# EAGLE board SNCHN_II-03 (EAGLE 5.11), part 1 of 2
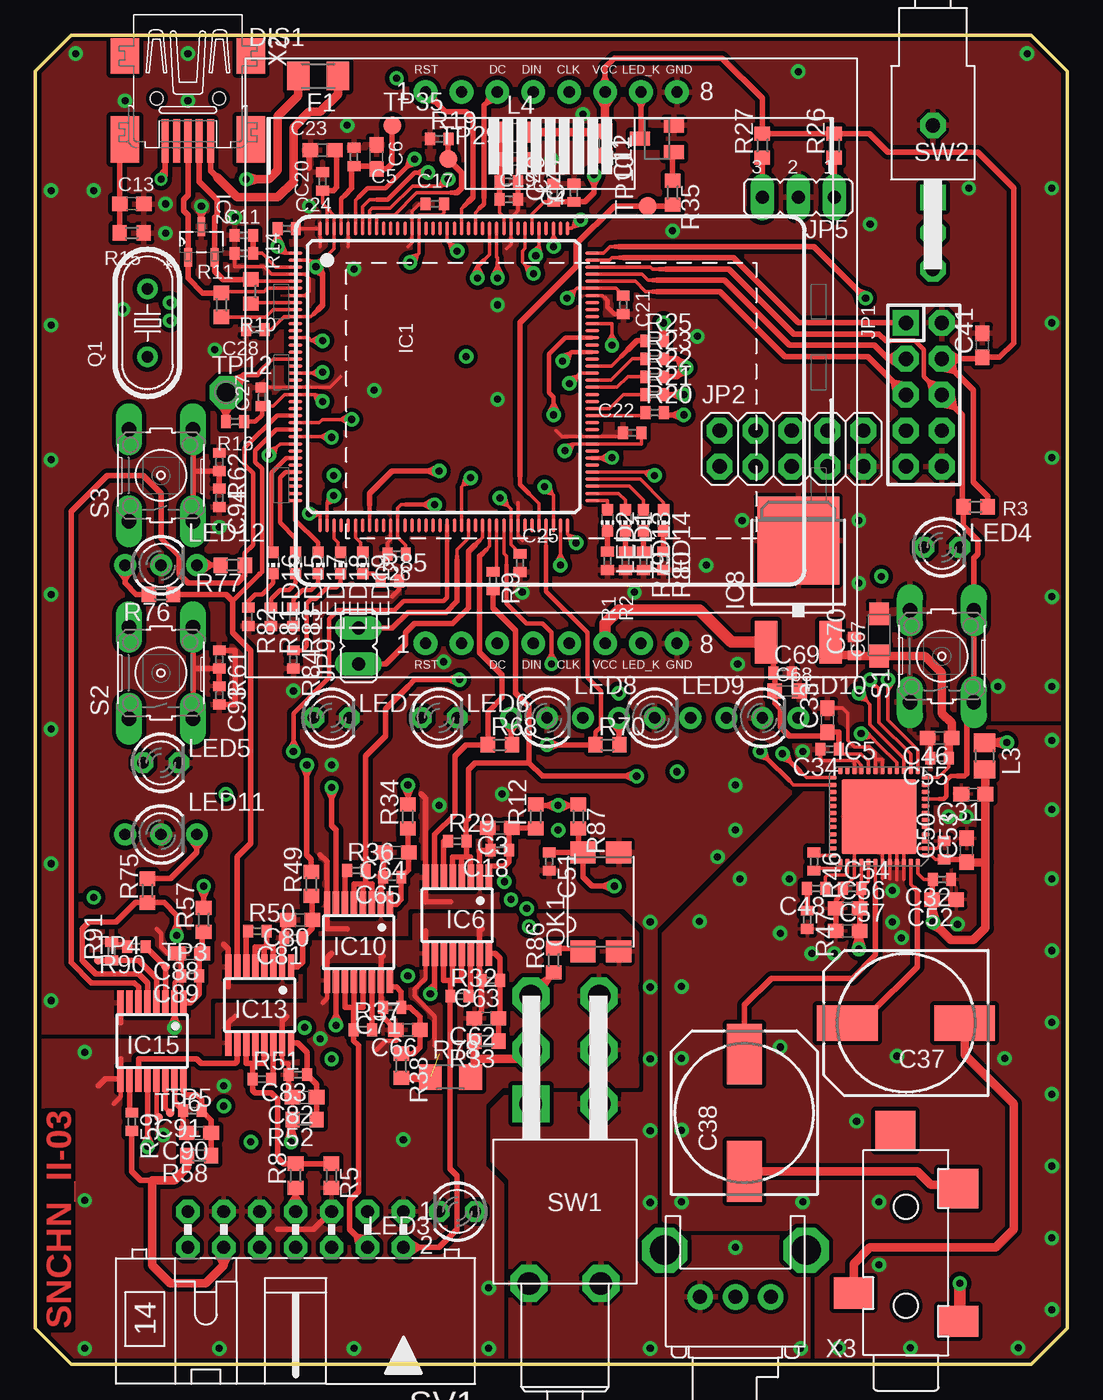
[diagram p5: board, top side]
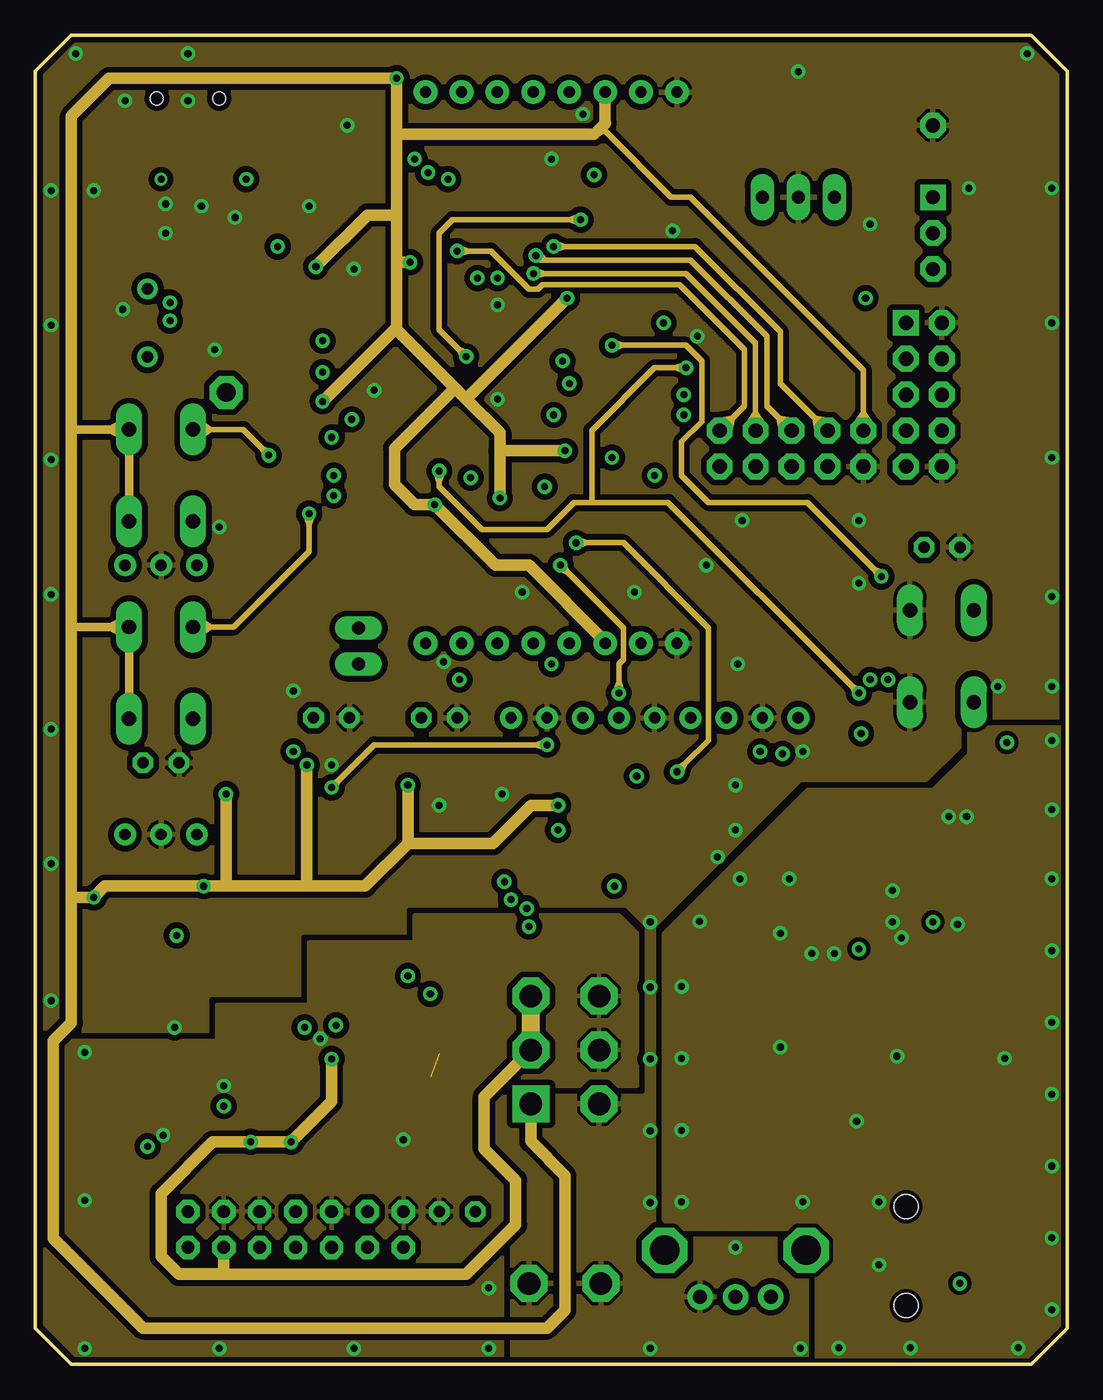
[diagram p6: board, inner layer Route2]
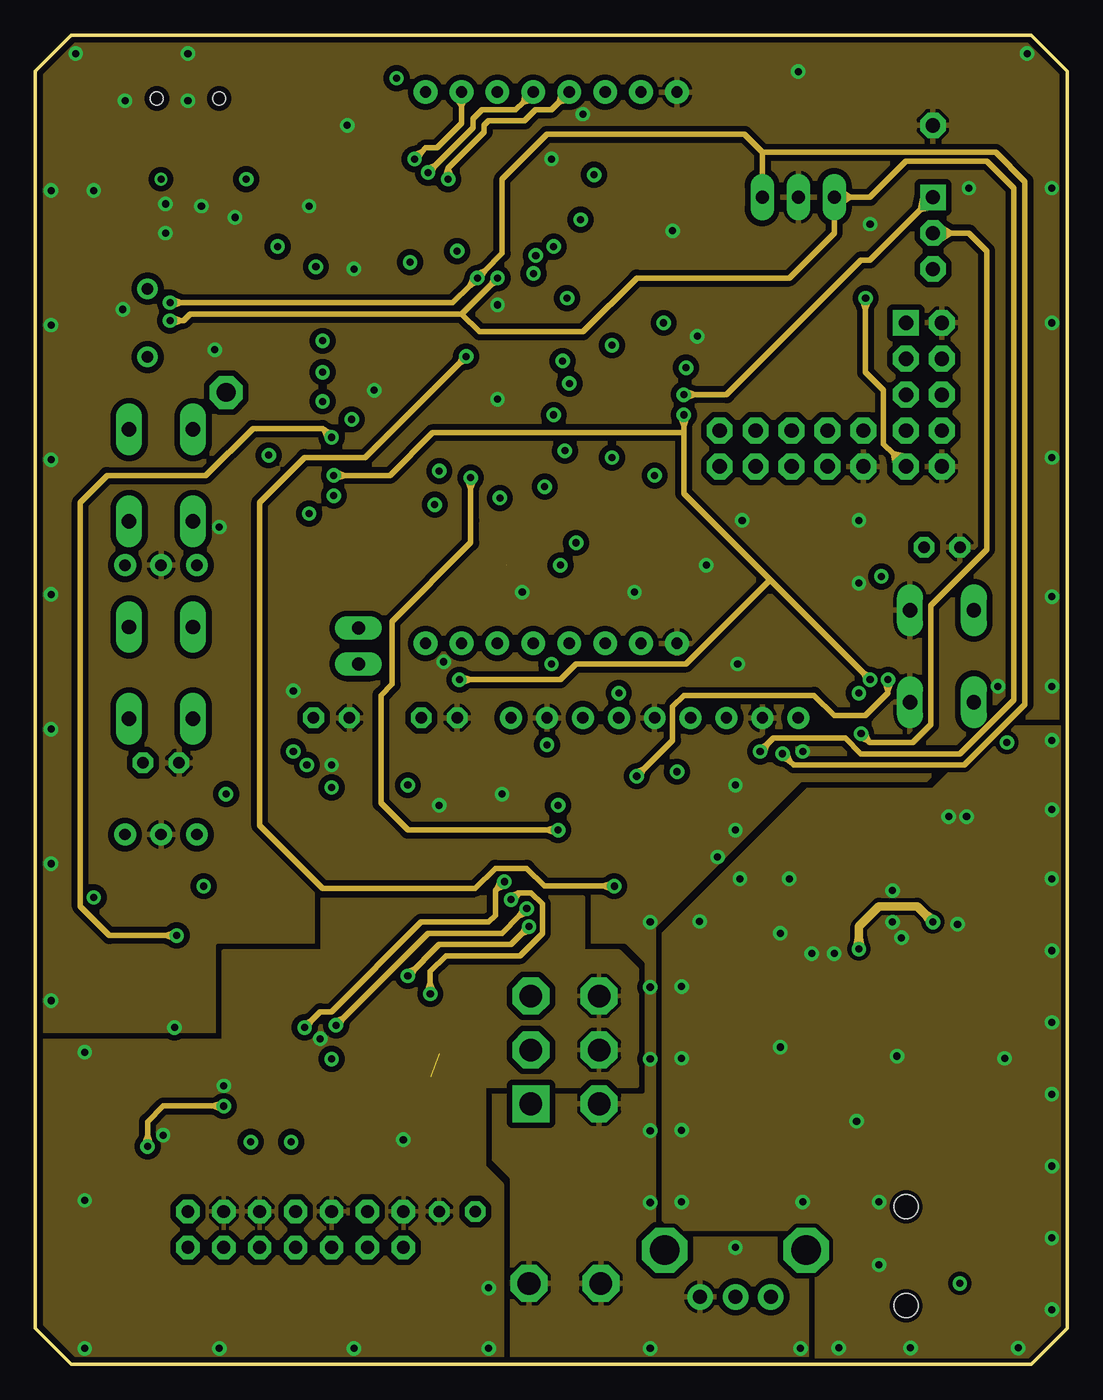
[diagram p7: board, inner layer Route15]
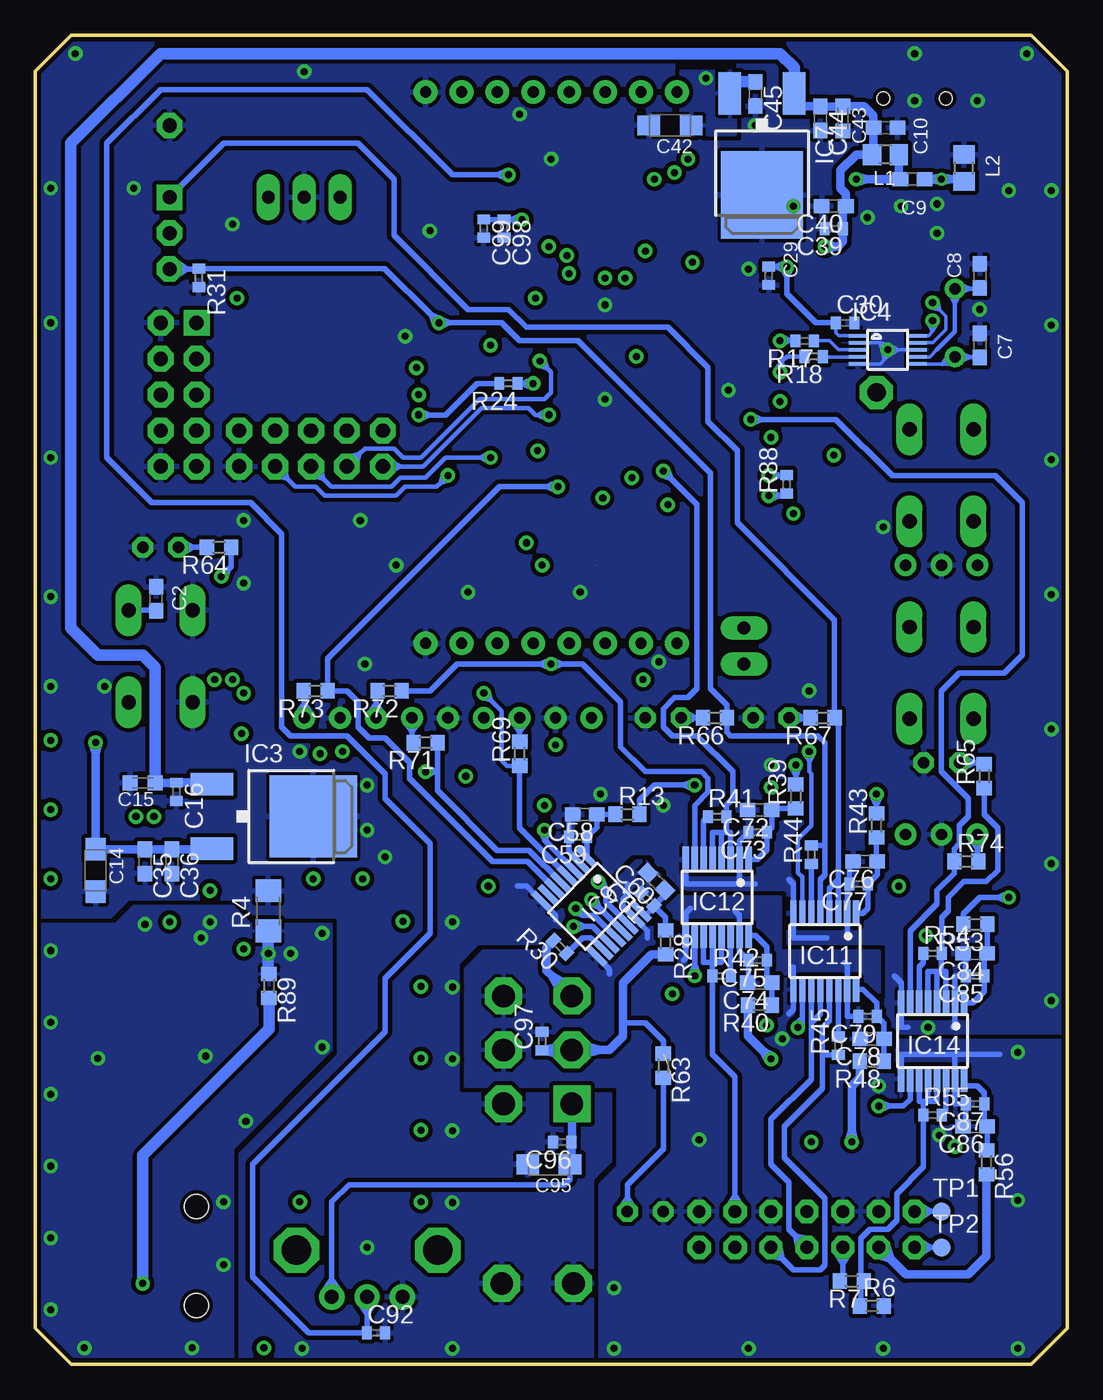
[diagram p8: board, bottom side, seen from below]

Size 73 x 94 mm. Coordinates in mm from the lower left corner, seen from the top.
Outline: 73,91.46 70.46,94 2.54,94 0,91.46 0,2.54 2.54,0 70.46,0 73,2.54 73,91.46
Copper layers (1*2*15*16): Top 0.035mm / dielectric 0.45mm / Route2 0.035mm / dielectric 0.45mm / Route15 0.035mm / dielectric 0.45mm / Bottom 0.035mm
Design rules "gatema_4_layers *": minimum track width 0.2mm, minimum drill 0.5mm, track to track 0.2mm, track to pad 0.2mm, pad to pad 0.2mm, via to via 0.2mm, smd to smd 0.2mm, copper to edge 0.3mm, drill to drill 8mil, minimum pad ring 10mil, minimum via ring 8mil, stop-mask expansion 4mil, vias tented up to drill 0.6mm, thermal gap 10mil
Net classes: 0 default: width 0.254 mm, drill 0.5 mm, clearance 0.2 mm; 1 High Speed: width 0.254 mm, drill 0.5 mm, clearance 0.508 mm
tKeepout: area 0,0 to 5.1,94; area 68.1,0 to 73,94
tRestrict: area 19.7,90.2 to 20.3,92.1; area 59.1,51.1 to 60.3,52.1; area 43.7,86.2 to 44.3,87.2
bRestrict: area 68.1,34.4 to 69.4,35.4; area 27.6,87 to 28.6,88.3; area 36.2,13.5 to 37.1,14.8; area 6.3,28.7 to 6.7,29.1

## Footprints (pad centres in the part's own frame; a part is rotated, then mirrored left to right if it is on the bottom)
C0402 = smd 0.7 x 0.9: 1 -0.65,0; 2 0.65,0
C0603 = smd 1.1 x 1: 1 -0.85,0; 2 0.85,0
SMC_A = smd 1.6 x 1.4: + -1.5,0; - 1.5,0
C0603R = smd 1.05 x 1.08: 1 -0.875,0; 2 0.875,0
140CLH-1010 = smd 4.3 x 2.5: + 4.15,0; - -4.15,0
LCD_NOKIA_5510_PLUS_EXT_BRD = drill 0.8 pad 1.676 round: 1 -8.89,19.5; 1@1 -8.89,-19.5; 2 -6.35,19.5; 2@1 -6.35,-19.5; 3 -3.81,19.5; 3@1 -3.81,-19.5; 4 -1.27,19.5; 4@1 -1.27,-19.5; 5 1.27,19.5; 5@1 1.27,-19.5; 6 3.81,19.5; 6@1 3.81,-19.5; 7 6.35,19.5; 7@1 6.35,-19.5; 8 8.89,19.5; 8@1 8.89,-19.5
M1206 = smd 1.6 x 2: 1 -1.4,0; 2 1.4,0
LQFP144 = smd 0.25 x 1: 1 -8.75,-10.5; 2 -8.25,-10.5; 3 -7.75,-10.5; 4 -7.25,-10.5; 5 -6.75,-10.5; 6 -6.25,-10.5; 7 -5.75,-10.5; 8 -5.25,-10.5; 9 -4.75,-10.5; 10 -4.25,-10.5; 11 -3.75,-10.5; 12 -3.25,-10.5; 13 -2.75,-10.5; 14 -2.25,-10.5; 15 -1.75,-10.5; 16 -1.25,-10.5; 17 -0.75,-10.5; 18 -0.25,-10.5; 19 0.25,-10.5; 20 0.75,-10.5; 21 1.25,-10.5; 22 1.75,-10.5; 23 2.25,-10.5; 24 2.75,-10.5; 25 3.25,-10.5; 26 3.75,-10.5; 27 4.25,-10.5; 28 4.75,-10.5; 29 5.25,-10.5; 30 5.75,-10.5; 31 6.25,-10.5; 32 6.75,-10.5; 33 7.25,-10.5; 34 7.75,-10.5; 35 8.25,-10.5; 36 8.75,-10.5; 73 8.75,10.5; 74 8.25,10.5; 75 7.75,10.5; 76 7.25,10.5; 77 6.75,10.5; 78 6.25,10.5; 79 5.75,10.5; 80 5.25,10.5; 81 4.75,10.5; 82 4.25,10.5; 83 3.75,10.5; 84 3.25,10.5; 85 2.75,10.5; 86 2.25,10.5; 87 1.75,10.5; 88 1.25,10.5; 89 0.75,10.5; 90 0.25,10.5; 91 -0.25,10.5; 92 -0.75,10.5; 93 -1.25,10.5; 94 -1.75,10.5; 95 -2.25,10.5; 96 -2.75,10.5; 97 -3.25,10.5; 98 -3.75,10.5; 99 -4.25,10.5; 100 -4.75,10.5; 101 -5.25,10.5; 102 -5.75,10.5; 103 -6.25,10.5; 104 -6.75,10.5; 105 -7.25,10.5; 106 -7.75,10.5; 107 -8.25,10.5; 108 -8.75,10.5 | smd 1 x 0.25: 37 10.5,-8.75; 38 10.5,-8.25; 39 10.5,-7.75; 40 10.5,-7.25; 41 10.5,-6.75; 42 10.5,-6.25; 43 10.5,-5.75; 44 10.5,-5.25; 45 10.5,-4.75; 46 10.5,-4.25; 47 10.5,-3.75; 48 10.5,-3.25; 49 10.5,-2.75; 50 10.5,-2.25; 51 10.5,-1.75; 52 10.5,-1.25; 53 10.5,-0.75; 54 10.5,-0.25; 55 10.5,0.25; 56 10.5,0.75; 57 10.5,1.25; 58 10.5,1.75; 59 10.5,2.25; 60 10.5,2.75; 61 10.5,3.25; 62 10.5,3.75; 63 10.5,4.25; 64 10.5,4.75; 65 10.5,5.25; 66 10.5,5.75; 67 10.5,6.25; 68 10.5,6.75; 69 10.5,7.25; 70 10.5,7.75; 71 10.5,8.25; 72 10.5,8.75; 109 -10.5,8.75; 110 -10.5,8.25; 111 -10.5,7.75; 112 -10.5,7.25; 113 -10.5,6.75; 114 -10.5,6.25; 115 -10.5,5.75; 116 -10.5,5.25; 117 -10.5,4.75; 118 -10.5,4.25; 119 -10.5,3.75; 120 -10.5,3.25; 121 -10.5,2.75; 122 -10.5,2.25; 123 -10.5,1.75; 124 -10.5,1.25; 125 -10.5,0.75; 126 -10.5,0.25; 127 -10.5,-0.25; 128 -10.5,-0.75; 129 -10.5,-1.25; 130 -10.5,-1.75; 131 -10.5,-2.25; 132 -10.5,-2.75; 133 -10.5,-3.25; 134 -10.5,-3.75; 135 -10.5,-4.25; 136 -10.5,-4.75; 137 -10.5,-5.25; 138 -10.5,-5.75; 139 -10.5,-6.25; 140 -10.5,-6.75; 141 -10.5,-7.25; 142 -10.5,-7.75; 143 -10.5,-8.25; 144 -10.5,-8.75
SOT95P237X112-3N = smd 1.321 x 0.559: 1 -1.092,0.94; 2 -1.092,-0.94; 3 1.092,0
DPACK = smd 1.6 x 3: 1 -2.28,-4.8; 3 2.28,-4.8 | smd 5.8 x 6.2: 4 0,2.38
MSOP10 = smd 0.25 x 1.3: 1 -1,-2.113; 2 -0.5,-2.113; 3 0,-2.113; 4 0.5,-2.113; 5 1,-2.113; 6 1,2.113; 7 0.5,2.113; 8 0,2.113; 9 -0.5,2.113; 10 -1,2.113
QFN48 = smd 0.55 x 0.3: 1 -3.275,2.75; 2 -3.275,2.25; 3 -3.275,1.75; 4 -3.275,1.25; 5 -3.275,0.75; 6 -3.275,0.25; 7 -3.275,-0.25; 8 -3.275,-0.75; 9 -3.275,-1.25; 10 -3.275,-1.75; 11 -3.275,-2.25; 12 -3.275,-2.75; 25 3.275,-2.75; 26 3.275,-2.25; 27 3.275,-1.75; 28 3.275,-1.25; 29 3.275,-0.75; 30 3.275,-0.25; 31 3.275,0.25; 32 3.275,0.75; 33 3.275,1.25; 34 3.275,1.75; 35 3.275,2.25; 36 3.275,2.75 | smd 0.3 x 0.55: 13 -2.75,-3.275; 14 -2.25,-3.275; 15 -1.75,-3.275; 16 -1.25,-3.275; 17 -0.75,-3.275; 18 -0.25,-3.275; 19 0.25,-3.275; 20 0.75,-3.275; 21 1.25,-3.275; 22 1.75,-3.275; 23 2.25,-3.275; 24 2.75,-3.275; 37 2.75,3.275; 38 2.25,3.275; 39 1.75,3.275; 40 1.25,3.275; 41 0.75,3.275; 42 0.25,3.275; 43 -0.25,3.275; 44 -0.75,3.275; 45 -1.25,3.275; 46 -1.75,3.275; 47 -2.25,3.275; 48 -2.75,3.275 | smd 5.309 x 5.309: EXP 0,0
QSOP16 = smd 0.45 x 1.8: 1 -2.223,-2.69; 2 -1.587,-2.69; 3 -0.953,-2.69; 4 -0.318,-2.69; 5 0.318,-2.69; 6 0.953,-2.69; 7 1.587,-2.69; 8 2.223,-2.69; 9 2.223,2.69; 10 1.587,2.69; 11 0.953,2.69; 12 0.318,2.69; 13 -0.318,2.69; 14 -0.953,2.69; 15 -1.587,2.69; 16 -2.223,2.69
AVR-JTAG-10 = drill 1.016 square: 1 -5.08,-1.27 | drill 1.016 octagon: 2 -5.08,1.27; 3 -2.54,-1.27; 4 -2.54,1.27; 5 0,-1.27; 6 0,1.27; 7 2.54,-1.27; 8 2.54,1.27; 9 5.08,-1.27; 10 5.08,1.27
2X05 = drill 1.016 octagon: 1 -5.08,-1.27; 2 -5.08,1.27; 3 -2.54,-1.27; 4 -2.54,1.27; 5 0,-1.27; 6 0,1.27; 7 2.54,-1.27; 8 2.54,1.27; 9 5.08,-1.27; 10 5.08,1.27
JP2 = drill 0.914 long: 1 -2.54,0; 2 0,0; 3 2.54,0
JP1 = drill 0.914 long: 1 0,-1.27; 2 0,1.27
L0805 = smd 1.3 x 1.5: 1 -0.95,0; 2 0.95,0
CHIP-LED0603 = smd 0.8 x 0.8: A 0,-0.75; C 0,0.75
LED3MM = drill 0.813 octagon: A -1.27,0; K 1.27,0
DUOLED-C-3MM = drill 0.8 pad 1.55 round: AR 2.54,0; AX -2.54,0; C 0,0
SMD4 = smd 1.78 x 1.55: 1 -1.27,-3.5; 2 1.27,-3.5; 3 1.27,3.5; 4 -1.27,3.5
HC49U-V = drill 0.813 round: 1 -2.413,0; 2 2.413,0
R0402 = smd 0.7 x 0.9: 1 -0.65,0; 2 0.65,0
R0603 = smd 1 x 1.1: 1 -0.85,0; 2 0.85,0
R1206 = smd 1.6 x 1.803: 1 -1.422,0; 2 1.422,0
TRIM_RK09K1110AK4 = drill 1 pad 1.676 round: 1 0,-2.5; 2 0,0; 3 0,2.5 | drill 2.1 pad 3.2 octagon: SHIELD_1 -3.3,5; SHIELD_2 -3.3,-5
B3F-10XX = drill 1.016 long: 1 -3.251,2.261; 2 3.251,2.261; 3 -3.251,-2.261; 4 3.251,-2.261
ML14L = drill 0.914 octagon: 1 -7.62,-1.27; 2 -7.62,1.27; 3 -5.08,-1.27; 4 -5.08,1.27; 5 -2.54,-1.27; 6 -2.54,1.27; 7 0,-1.27; 8 0,1.27; 9 2.54,-1.27; 10 2.54,1.27; 11 5.08,-1.27; 12 5.08,1.27; 13 7.62,-1.27; 14 7.62,1.27
1MD3T2B4M7XX = drill 1.6 square: 1 -2.415,0 | drill 1.6 octagon: 2 -2.415,3.81; 3 -2.415,7.62; 4 2.415,0; 5 2.415,3.81; 6 2.415,7.62; SH1 -2.54,-12.7; SH2 2.54,-12.7
2AS2T2A1M7RE = drill 1 square: 1 0,0 | drill 1 octagon: 2 0,2.54; 3 0,5.08; SH 0,-5.08
SC59-BEC = smd 1 x 1.4: B -0.95,-1.2; C 0,1.2; E 0.95,-1.2
B1,27 = smd 1.27 x 1.27: TP 0,0
TP06R = smd 0.6 x 0.6: TP 0,0
P1-13 = drill 1.321 pad 2.159 octagon: TP 0,0
32005-201 = smd 3.1 x 0.5: 1 3,1.6; 2 3,0.8; 3 3,0; 4 3,-0.8; 5 3,-1.6 | smd 2.5 x 2: M1 -3,-4.45; M2 -3,4.45 | smd 3.3 x 2: M3 2.9,4.45; M4 2.9,-4.45 | hole 0.9: 0,2.2; 0,-2.2
STEREO_JACK_3.5MM_SMD_SJ-352X-SMT = smd 2.8 x 2.2: P$1 -3.7,-2.4; P$3 3.7,-4.4 | smd 2.8 x 2.8: P$2 -3.7,-11.8; P$10 0.75,-15.9 | hole 1.7: 0,-3.5; 0,-10.5

## Placement (x,y rotation side)
C1  100n  [C0402]  33.5,83.66 0 top
C2  220n  [C0603]  64.45,54.13 90 bottom
C3  1u  [C0603]  32.86,37.94 180 top
C4  1n  [C0402]  33.5,82.39 0 top
C5  1n  [C0402]  22.54,85.41 90 top
C6  1u  [C0603]  24.13,85.41 90 top
C7  10p(22p)  [C0603]  6.19,72.07 90 bottom
C8  10p(22p)  [C0603]  6.19,76.99 90 bottom
C9  1n  [C0603]  10.95,83.82 0 bottom
C10  100n  [C0603]  12.86,87.47 0 bottom
C11  10pF(22p)  [C0402]  14.76,79.85 180 top
C12  1u  [C0603]  40.32,86.36 270 top
C13  10n  [C0603]  6.83,82.07 0 top
C14  4.7uF  [SMC_A]  68.74,34.92 270 bottom
C15  1uF  [C0603R]  65.41,41.12 180 bottom
C16  100n  [C0402]  63.02,40.48 270 bottom
C17  100n  [C0402]  28.26,82.07 180 top
C18  100n  [C0402]  32.86,36.35 180 top
C19  1u  [C0603]  33.81,85.25 0 top
C20  100n  [C0402]  20.32,83.66 90 top
C21  100n  [C0402]  41.59,74.93 270 top
C22  100n  [C0402]  42.23,65.88 180 top
C23  1u  [C0603]  20.32,85.88 180 top
C24  1n  [C0402]  17.78,80.33 0 top
C25  100n  [C0402]  34.29,56.67 270 top
C26  100n  [C0402]  25.56,57.31 180 top
C27  100n  [C0402]  16.03,68.42 90 top
C28  100n  [C0402]  15.56,73.18 0 top
C29  100n  [C0402]  21.11,76.99 270 bottom
C30  100n  [C0402]  15.72,73.66 0 bottom
C31  1u  [C0603]  66.36,40.32 180 top
C32  100n  [C0402]  64.14,34.29 180 top
C33  1u  [C0603]  56.04,45.56 90 top
C34  100n  [C0402]  56.2,43.5 180 top
C35  100n  [C0603]  65.25,35.56 270 bottom
C36  10n  [C0603]  63.34,35.56 270 bottom
C37  220uF  [140CLH-1010]  61.59,24.13 180 top
C38  220uF  [140CLH-1010]  50.16,17.78 90 top
C39  100n  [C0402]  16.51,80.33 180 bottom
C40  1u  [C0603]  16.51,81.92 180 bottom
C41  10n  [C0603]  66.99,72.07 90 top
C42  4.7uF  [SMC_A]  28.1,87.63 180 bottom
C43  1uF  [C0603R]  15.87,88.11 270 bottom
C44  100n  [C0603]  17.46,88.11 270 bottom
C45  100n  [C0603]  22.07,89.85 270 bottom
C46  1u  [C0603]  63.98,44.29 180 top
C47  100n  [C0402]  38.1,82.87 90 top
C48  220n  [C0402]  55.24,33.66 180 top
C49  10n  [C0402]  36.67,82.87 90 top
C50  100n  [C0402]  64.29,36.35 90 top
C51  10n  [C0402]  36.35,35.56 270 top
C52  1u  [C0603]  64.29,32.86 180 top
C53  1u  [C0603]  65.88,36.35 90 top
C54  100n  [C0402]  57.79,33.66 0 top
C55  100n  [C0402]  63.98,42.86 180 top
C56  1u  [C0603]  57.47,32.23 0 top
C57  1u  [C0603]  57.47,30.64 0 top
C58  1u  [C0603]  34.13,38.89 180 bottom
C59  100n  [C0402]  34.61,37.31 180 bottom
C60  1u  [C0603]  29.05,34.13 135 bottom
C61  100n  [C0402]  29.69,32.86 135 bottom
C62  1u  [C0603]  31.91,24.45 180 top
C63  100n  [C0402]  32.23,27.15 180 top
C64  1u  [C0603]  25.56,36.2 180 top
C65  100n  [C0402]  25.24,34.45 180 top
C66  1u  [C0603]  26.35,23.65 180 top
C67  4.7uF  [SMC_A]  59.69,51.59 90 top
C68  1uF  [C0603R]  53.18,47.63 0 top
C69  100n  [C0402]  52.86,48.89 0 top
C70  100n  [C0402]  57.94,50.8 90 top
C71  100n  [C0402]  25.24,25.24 180 top
C72  1u  [C0603]  21.75,39.21 180 bottom
C73  100n  [C0402]  21.91,37.62 180 bottom
C74  1u  [C0603]  21.75,26.99 180 bottom
C75  100n  [C0402]  21.91,28.57 180 bottom
C76  1u  [C0603]  14.29,35.56 180 bottom
C77  100n  [C0402]  14.76,33.97 180 bottom
C78  1u  [C0603]  13.81,23.02 180 bottom
C79  100n  [C0402]  14.13,24.61 180 bottom
C80  1u  [C0603]  18.73,31.43 180 top
C81  100n  [C0402]  18.26,30.16 180 top
C82  1u  [C0603]  19.05,18.89 180 top
C83  100n  [C0402]  18.57,20.48 180 top
C84  1u  [C0603]  6.51,29.05 180 bottom
C85  100n  [C0402]  6.51,27.46 180 bottom
C86  1u  [C0603]  6.51,16.83 180 bottom
C87  100n  [C0402]  6.51,18.41 180 bottom
C88  1u  [C0603]  10.95,29.05 180 top
C89  100n  [C0402]  10.95,27.46 180 top
C90  1u  [C0603]  11.59,16.35 180 top
C91  100n  [C0402]  11.11,17.94 180 top
C92  220n  [C0402]  48.9,2.22 0 bottom
C93  100n  [C0402]  13.02,47.31 270 top
C94  100n  [C0402]  13.02,61.28 270 top
C95  4.7uF  [SMC_A]  36.67,14.13 180 bottom
C96  100n  [C0402]  35.72,15.72 180 bottom
C97  100n  [C0402]  37.15,22.86 90 bottom
C98  10n  [C0402]  39.85,80.33 270 bottom
C99  100n  [C0402]  41.27,80.33 270 bottom
DIS1  LCD_NOKIA_5510  [LCD_NOKIA_5510_PLUS_EXT_BRD]  36.5,70.48 0 top
F1  1A SLOW  [M1206]  20,91.12 180 top
IC1  AT32UC3A3256  [LQFP144]  28.89,69.85 270 top
IC2  TPD2E009DBZR  [SOT95P237X112-3N]  11.75,79.38 90 top
IC3  LF33ABDT-TR  [DPACK]  55.72,38.73 270 bottom
IC4  CS2200  [MSOP10]  12.7,71.75 270 bottom
IC5  TLV320AIC33  [QFN48]  59.69,38.73 0 top
IC6  SI8642QSOP16  [QSOP16]  29.84,31.75 180 top
IC7  LF33ABDT-TR  [DPACK]  21.59,85.09 180 bottom
IC8  LD39300DT18-R  [DPACK]  53.98,55.88 0 top
IC9  SI8640QSOP16  [QSOP16]  33.66,32.38 225 bottom
IC10  SI8642QSOP16  [QSOP16]  22.86,29.84 180 top
IC11  SI8642QSOP16  [QSOP16]  17.14,29.21 180 bottom
IC12  SI8642QSOP16  [QSOP16]  24.77,33.02 180 bottom
IC13  SI8642QSOP16  [QSOP16]  15.88,25.4 180 top
IC14  SI8642QSOP16  [QSOP16]  9.53,22.86 180 bottom
IC15  SI8640QSOP16  [QSOP16]  8.26,22.86 180 top
JP1  AVR-JTAG-10  [AVR-JTAG-10]  62.87,68.58 270 top
JP2  GPIO  [2X05]  53.5,64.77 0 top
JP5  I2C 0 probe  [JP2]  53.98,82.55 180 top
JP9  DBG_UART  [JP1]  22.86,50.8 0 top
L1  33u  [L0805]  12.86,85.57 180 bottom
L2  33u  [L0805]  7.3,84.61 90 bottom
L3  33u  [L0805]  67.15,43.02 270 top
L4  33u  [L0805]  33.97,87.15 0 top
LED1  [CHIP-LED0603]  41.75,59.69 180 top
LED2  [CHIP-LED0603]  40.48,59.69 180 top
LED3  Green (2V@5mA)  [LED3MM]  29.84,10.79 180 top
LED4  Red (1.8V@5mA)  [LED3MM]  64.14,57.78 0 top
LED5  Yellow (2.2V@5mA)  [LED3MM]  8.89,42.55 0 top
LED6  Green (1.9V@3mA)  [LED3MM]  28.57,45.72 0 top
LED7  Green (1.9V@3mA)  [LED3MM]  20.95,45.72 0 top
LED8  Red/Green  [DUOLED-C-3MM]  36.2,45.72 0 top
LED9  Red/Green  [DUOLED-C-3MM]  43.81,45.72 0 top
LED10  Red/Green  [DUOLED-C-3MM]  51.44,45.72 0 top
LED11  Red/Green  [DUOLED-C-3MM]  8.89,37.47 0 top
LED12  Red/Green  [DUOLED-C-3MM]  8.89,56.52 0 top
LED13  [CHIP-LED0603]  43.02,59.69 180 top
LED14  [CHIP-LED0603]  44.45,59.69 180 top
LED15  [CHIP-LED0603]  18.41,56.67 180 top
LED16  [CHIP-LED0603]  16.83,56.67 180 top
LED17  [CHIP-LED0603]  20,56.67 180 top
LED18  [CHIP-LED0603]  21.59,56.67 180 top
LED19  [CHIP-LED0603]  23.18,56.67 180 top
OK1  LTV816S  [SMD4]  40.01,32.7 0 top
Q1  12MHz  [HC49U-V]  7.94,73.66 270 top
R1  470  [R0402]  40.48,56.83 270 top
R2  470  [R0402]  41.75,56.83 270 top
R3  10k  [R0603]  66.52,60.64 0 top
R4  0R  [R1206]  56.51,32.07 90 bottom
R5  10k  [R0603]  20.96,13.34 270 top
R6  10k  [R0603]  13.81,4.13 0 bottom
R7  33R  [R0603]  15.24,5.87 180 bottom
R8  33R  [R0603]  18.41,13.34 90 top
R9  33R  [R0402]  32.38,55.4 270 top
R10  39R(33R)  [R0603]  15.24,75.88 270 top
R11  39R(33R)  [R0603]  13.18,74.93 270 top
R12  10R  [R0603]  35.4,38.74 90 top
R13  10R  [R0603]  31.11,38.89 0 bottom
R14  6k8  [R0402]  14.76,78.58 0 top
R15  1M  [R0603]  6.83,80.01 180 top
R16  10k  [R0402]  14.13,66.67 0 top
R17  33R  [R0402]  18.57,72.39 180 bottom
R18  33R  [R0402]  17.94,71.28 180 bottom
R19  2k2  [R0402]  28.57,86.68 0 top
R20  33R  [R0402]  43.81,67.31 0 top
R21  33R  [R0402]  43.81,68.58 0 top
R22  33R  [R0402]  43.81,69.85 0 top
R23  33R  [R0402]  43.81,71.12 0 top
R24  33R  [R0402]  39.53,69.37 180 bottom
R25  33R  [R0402]  43.81,72.39 0 top
R26  4k7  [R0603]  56.52,86.2 90 top
R27  4k7  [R0603]  51.44,86.2 90 top
R28  10R  [R0603]  28.42,29.84 270 bottom
R29  33R  [R0402]  29.84,36.99 0 top
R30  330R  [R0402]  35.88,29.53 135 bottom
R31  47k  [R0402]  61.44,76.84 270 bottom
R32  33R  [R0402]  30,26.04 0 top
R33  10R  [R0603]  31.91,22.86 180 top
R34  10R  [R0603]  26.35,38.74 90 top
R35  22R  [R0603]  45.08,82.87 270 top
R36  33R  [R0402]  22.7,34.92 0 top
R37  33R  [R0402]  23.18,23.65 0 top
R38  10R  [R0603]  25.88,21.11 270 top
R39  10R  [R0603]  19.21,40.16 90 bottom
R40  10R  [R0603]  21.75,25.4 180 bottom
R41  33R  [R0402]  24.77,38.73 0 bottom
R42  33R  [R0402]  24.45,27.46 0 bottom
R43  10R  [R0603]  13.49,38.1 90 bottom
R44  33R  [R0402]  18.1,36.04 90 bottom
R45  33R  [R0402]  16.19,22.54 90 bottom
R46  10k  [R0402]  55.09,35.56 270 top
R47  33R  [R0402]  54.61,31.43 270 top
R48  10R  [R0603]  13.81,21.43 180 bottom
R49  10R  [R0603]  19.53,33.97 90 top
R50  33R  [R0402]  15.72,30.64 0 top
R51  33R  [R0402]  16.03,20.16 0 top
R52  10R  [R0603]  19.05,17.3 180 top
R53  10R  [R0603]  6.51,31.11 180 bottom
R54  33R  [R0402]  9.53,29.05 0 bottom
R55  33R  [R0402]  9.53,17.62 0 bottom
R56  10R  [R0603]  5.72,14.29 270 bottom
R57  10R  [R0603]  11.91,31.43 90 top
R58  10R  [R0603]  11.59,14.76 180 top
R59  330R  [R0402]  6.83,17.14 270 top
R60  10k  [TRIM_RK09K1110AK4]  49.53,4.76 270 top
R61  10k  [R0402]  13.02,49.85 270 top
R62  10k  [R0402]  13.02,63.82 270 top
R63  270R  [R0603]  28.57,21.11 270 bottom
R64  330R  [R0603]  60.01,57.78 180 bottom
R65  220R  [R0603]  5.87,41.59 90 bottom
R66  390R  [R0603]  24.92,45.72 180 bottom
R67  390R  [R0603]  17.3,45.72 180 bottom
R68  330R  [R0603]  32.86,43.82 0 top
R69  270R  [R0603]  38.73,43.18 90 bottom
R70  330R  [R0603]  40.48,43.82 0 top
R71  270R  [R0603]  45.4,43.97 180 bottom
R72  330R  [R0603]  47.94,47.62 180 bottom
R73  270R  [R0603]  53.18,47.62 180 bottom
R74  330R  [R0603]  7.14,35.56 0 bottom
R75  270R  [R0603]  7.94,33.5 90 top
R76  330R  [R0603]  8.89,54.45 180 top
R77  270R  [R0603]  13.97,56.52 180 top
R78  0R  [R1206]  29.37,20.32 0 top
R79  470  [R0402]  43.02,56.83 270 top
R80  470  [R0402]  44.45,56.83 270 top
R81  470  [R0402]  16.67,52.86 270 top
R82  470  [R0402]  15.08,52.86 270 top
R83  470  [R0402]  18.26,52.86 270 top
R84  470  [R0402]  18.26,49.85 270 top
R85  470  [R0402]  25.08,55.4 0 top
R86  470R  [R0603]  36.67,28.57 90 top
R87  1k  [R0603]  38.42,38.73 270 top
R88  33R  [R0402]  19.84,62.23 90 bottom
R89  0R  [R0603]  56.46,26.75 270 bottom
R90  10k  [R0402]  7.14,29.53 180 top
R91  10k  [R0402]  5.4,29.21 90 top
S1  Manual reset  [B3F-10XX]  64.14,50.08 90 top
S2  MUTE  [B3F-10XX]  8.89,48.9 90 top
S3  RESET I2S  [B3F-10XX]  8.89,62.87 90 top
SV1  I2S CONNECTOR  [ML14L]  18.41,9.53 180 top
SW1  PWR_CON  [1MD3T2B4M7XX]  37.47,18.41 0 top
SW2  CODEC_DATA_SRC  [2AS2T2A1M7RE]  63.5,82.55 180 top
T1  KRC402E  [SC59-BEC]  43.97,86.68 90 top
TP1  PTR1B1,27  [B1,27]  8.89,10.79 0 bottom
TP2  PTR1B1,27  [B1,27]  8.89,8.26 0 bottom
TP3  PTR1TP06R  [TP06R]  9.21,28.1 0 top
TP4  PTR1TP06R  [TP06R]  4.45,28.57 0 top
TP5  PTR1TP06R  [TP06R]  9.53,17.78 0 top
TP6  PTR1TP06R  [TP06R]  8.73,17.46 0 top
TP10  PTR1B1,27  [B1,27]  43.34,81.92 90 top
TP12  PTR1PAD1-13  [P1-13]  13.49,68.74 0 top
TP29  PTR1B1,27  [B1,27]  29.21,85.25 0 top
TP35  PTR1B1,27  [B1,27]  25.24,87.63 0 top
X2  MINI-USB-SHIELD  [32005-201]  10.79,89.53 270 top
X3  Headphones  [STEREO_JACK_3.5MM_SMD_SJ-352X-SMT]  61.59,0.64 180 top

## Tracks (layer width: path | path; a pad name or v marks a point on that pad's centre or on a via)
+1.8V
  Top 0.254: C55.1 64.63,42.24 63.87,41.48 IC5.36
  Top 0.406: 56.26,50.15 IC8.3 | 57.94,50.09 C70.1
  Top 0.61: C55.1 64.63,44.09 C46.1 64.83,45.35 64.14,46.04 64.14,48.9 62.94,50.09 C67.+ 57.94,50.09 | C70.1 56.26,50.15
+3V3  (via drill 0.5 pad 1.02)
  Top 0.254: 19.26,78.1 19.37,78.1 v19.84,77.63 | 19.26,78.1 IC1.2 | C28.2 16.67,73.18 17.59,74.1 IC1.10 19.49,74.1 19.68,74.3 | 20.64,81.76 IC1.143 | 20.64,81.76 21.14,81.26 IC1.142 21.14,78.93 20.37,78.16 | C17.1 28.91,81.45 28.73,81.28 27.14,81.28 IC1.130 27.14,78.58 27.04,78.48 | 20.64,81.76 20.32,82.08 C20.1 | C21.1 41.07,76.1 IC1.103 38.32,76.1 38.15,75.94 | IC5.44 58.94,42.66 58.42,43.18 57.01,43.18 57.01,43.34 C34.1 | v19.84,77.63 20.37,78.16 | C27.1 16.81,67.77 17.64,68.6 IC1.21 19.76,68.6 | 19.76,68.6 19.82,68.6 v20.32,68.1 | v32.86,61.28 33.39,60.75 | 33.39,60.75 33.64,60.5 IC1.64 33.64,57.97 C25.1 | C22.1 42.88,65.1 IC1.81 38.03,65.1 | v37.47,64.61 37.95,65.1 38.03,65.1 | v37.62,75.41 38.15,75.94 | C26.1 26.21,57.93 25.64,58.49 IC1.48 25.64,60.57 25.88,60.8 26.19,60.8 | v26.51,77.95 27.04,78.48 | 19.26,78.1 19.49,77.5 v19.84,77.63 | 19.26,78.1 19.9,78.01 v19.84,77.63 | 20.37,78.16 19.75,78 v19.84,77.63 | 20.37,78.16 20.21,77.53 v19.84,77.63 | 19.76,68.6 19.96,67.99 v20.32,68.1 | 19.76,68.6 20.39,68.48 v20.32,68.1 | 33.39,60.75 33.23,61.37 v32.86,61.28 | 33.39,60.75 32.77,60.91 v32.86,61.28 | 27.04,78.48 26.42,78.31 v26.51,77.95 | 27.04,78.48 26.88,77.85 v26.51,77.95 | 38.03,65.1 37.4,64.99 v37.47,64.61 | 38.03,65.1 37.83,64.49 v37.47,64.61 | 38.15,75.94 37.53,75.78 v37.62,75.41 | 38.15,75.94 37.99,75.31 v37.62,75.41
  Top 0.305: 20,74.61 19.68,74.3 | R16.2 15.56,66.67 16.03,67.15 C27.1 | v28.26,60.8 27.51,60.8 | 27.51,60.8 26.19,60.8 | 27.51,60.8 28.09,60.49 v28.26,60.8 | 27.51,60.8 28.09,61.11 v28.26,60.8
  Top 0.406: C20.1 21.1,83.01 21.33,83.24 21.33,85.88 C23.1 | C34.1 56.85,44.71 C33.1 56.04,44.45 53.34,44.45 52.7,45.09 52.7,46.35 52.31,46.75 C68.1 52.31,48.8 C69.1 52.21,51.08 IC8.1 | 20,74.61 20.32,74.93 20.32,77.05 | 20.32,77.05 20.32,77.15 v19.84,77.63 | v26.35,40.96 26.35,40.21 | 26.35,40.21 R34.2 | R49.2 19.53,35.72 19.21,36.04 19.21,41.64 | v19.21,42.39 19.21,41.64 | 11.85,32.23 R57.2 11.91,33.06 | v11.91,33.81 11.91,33.06 | DIS1.6 40.32,90 | 65.41,71.12 66.89,71.12 C41.1 68.21,71.22 69.22,72.23 69.22,83.19 66.67,85.72 60.33,85.72 59,87.05 R26.2 R27.2 51.44,89.53 48.58,92.39 40.96,92.39 40.31,91.75 40.31,90.98 | 65.41,71.12 JP1.4 | R12.2 35.46,39.53 36.24,39.53 | v36.99,39.53 36.24,39.53 | R87.1 38.36,39.53 37.74,39.53 | v36.99,39.53 37.74,39.53 | R3.2 67.37,61.38 66.36,62.39 66.36,68.9 65.03,70.22 | JP1.4 65.03,70.22 | DIS1.6 40.31,90.98 | 20.32,77.05 20.14,77.71 v19.84,77.63 | 20.32,77.05 19.71,77.36 v19.84,77.63 | 36.24,39.53 36.87,39.25 v36.99,39.53 | 36.24,39.53 36.87,39.81 v36.99,39.53 | 37.74,39.53 37.11,39.81 v36.99,39.53 | 37.74,39.53 37.11,39.25 v36.99,39.53 | 26.35,40.21 26.63,40.83 v26.35,40.96 | 26.35,40.21 26.07,40.83 v26.35,40.96 | 19.21,41.64 19.49,42.26 v19.21,42.39 | 19.21,41.64 18.93,42.26 v19.21,42.39 | 11.91,33.06 12.19,33.69 v11.91,33.81 | 11.91,33.06 11.63,33.69 v11.91,33.81 | 65.41,71.12 64.53,71.71 JP1.4 | 65.41,71.12 64.53,70.53 JP1.4 | 65.03,70.22 64.83,71.25 JP1.4 | 65.03,70.22 64,70.42 JP1.4 | 40.31,90.98 39.92,90.17 DIS1.6 | 40.31,90.98 40.7,90.17 DIS1.6
  Top 0.61: DIS1.6 40.31,88.98 | 40.31,88.98 40.31,87.22 C12.1 40.27,87.15 L4.2 | 40.31,88.98 40.76,89.7 DIS1.6 | 40.31,88.98 39.86,89.7 DIS1.6
  Top 0.813: IC8.1 49.25,51.08 46.99,53.34 41.27,53.34 40.31,52.38 DIS1.6@1
  Route2 0.406: 58.58,67.31 58.58,70.33 46.35,82.55 44.98,82.55 C12.1 39.79,87.21 39.77,87.23 | 58.58,67.31 JP2.10 | 58.58,67.31 57.99,66.44 JP2.10 | 58.58,67.31 59.17,66.44 JP2.10
  Route2 0.61: 29.69,69.06 29.61,68.98 29.77,68.98 | 25.56,77.47 25.56,77.95 | S3.2 6.63,64.85 | 6.63,64.85 6.63,60.88 | 6.63,60.88 S3.1 | 5.36,66.12 2.62,66.12 2.54,66.04 | 5.36,66.12 S3.2 | S2.2 6.63,50.88 | 6.63,50.88 6.63,46.91 | 6.63,46.91 S2.1 | 5.36,52.15 2.62,52.15 2.54,52.07 | 5.36,52.15 S2.2 | 23.34,33.81 19.21,33.81 | 12.66,33.81 13.49,33.81 | 12.66,33.81 11.94,33.96 v11.91,33.81 11.94,33.67 12.66,33.81 | 6.63,46.91 6.09,45.94 S2.1 | 6.63,46.91 7.16,45.94 S2.1 | 6.63,50.88 7.16,51.85 S2.2 | 6.63,50.88 6.09,51.85 S2.2 | 5.36,52.15 6.34,51.61 S2.2 | 5.36,52.15 6.34,52.68 S2.2 | 6.63,60.88 6.09,59.91 S3.1 | 6.63,60.88 7.16,59.91 S3.1 | 6.63,64.85 7.16,65.82 S3.2 | 6.63,64.85 6.09,65.82 S3.2 | 5.36,66.12 6.34,65.58 S3.2 | 5.36,66.12 6.34,66.65 S3.2 | 32.86,65.88 | 30.48,68.26
  Route2 0.813: SW1.1 35.05,15.75 37.47,13.34 37.47,3.81 36.2,2.54 7.62,2.54 1.27,8.89 1.27,22.86 2.54,24.13 2.54,33.02 | v25.56,90.96 25.56,87 | 25.56,87 25.56,81.28 | 25.56,81.28 25.56,77.47 25.56,73.18 | 32.86,64.61 v32.86,61.28 | 25.56,73.18 29.69,69.06 30.48,68.26 | 30.48,68.26 32.86,65.88 32.86,64.61 | 25.56,77.95 v26.51,77.95 | 2.54,33.02 2.54,52.07 2.54,66.04 2.54,88.27 5.24,90.96 v25.56,90.96 | 32.86,64.61 v37.47,64.61 | 30.48,68.26 v37.62,75.41 | 2.54,33.02 v4.13,33.02 4.92,33.81 v11.91,33.81 12.66,33.81 23.34,33.81 26.35,36.83 | 26.35,36.83 32.38,36.83 35.08,39.53 v36.99,39.53 | 26.35,36.83 v26.35,40.96 | 19.21,33.81 v19.21,42.39 | 13.49,33.81 v13.49,40.32 | v19.84,77.63 23.5,81.28 25.56,81.28 | v20.32,68.1 25.4,73.18 25.56,73.18 | v25.56,90.96 25.56,88.27 | 25.56,87 39.53,87 39.77,87.23 40.32,87.79 40.31,87.8 DIS1.6 | 29.61,68.98 25.4,64.77 25.4,62.23 26.83,60.8 v28.26,60.8 32.54,56.52 34.92,56.52 40.31,51.13 DIS1.6@1
  Bottom 0.254: IC4.1 16.14,72.75 16.37,72.98 C30.1
  Bottom 0.406: v19.84,77.63 20.59,77.63 | 20.59,77.63 C29.1 | v13.49,40.32 | v13.49,40.32 13.49,39.57 | 13.49,39.57 R43.2 | v19.21,42.39 19.21,41.64 | 19.21,41.64 R39.2 | R13.2 30.27,39.9 29.21,40.96 27.1,40.96 | v26.35,40.96 27.1,40.96 | C95.+ 35.17,13.09 35.56,12.7 50.8,12.7 52.03,11.47 52.03,6.01 | 52.03,6.01 R60.3 | C30.1 17.78,73.66 19.84,75.72 19.84,76.88 | v19.84,77.63 19.84,76.88 | v4.13,33.02 4.88,33.02 | 4.88,33.02 6.19,33.02 7.36,31.85 R53.2 | 20.59,77.63 19.97,77.91 v19.84,77.63 | 20.59,77.63 19.97,77.35 v19.84,77.63 | 19.84,76.88 20.12,77.5 v19.84,77.63 | 19.84,76.88 19.57,77.5 v19.84,77.63 | 27.1,40.96 26.48,41.24 v26.35,40.96 | 27.1,40.96 26.48,40.68 v26.35,40.96 | 19.21,41.64 19.49,42.26 v19.21,42.39 | 19.21,41.64 18.93,42.26 v19.21,42.39 | 13.49,39.57 13.77,40.2 v13.49,40.32 | 13.49,39.57 13.21,40.2 v13.49,40.32 | 4.88,33.02 4.25,33.3 v4.13,33.02 | 4.88,33.02 4.25,32.74 v4.13,33.02 | 52.03,6.01 51.45,5.15 R60.3 | 52.03,6.01 52.61,5.15 R60.3
  Bottom 0.61: SW1.1 35.05,15.73 C96.1 35.07,14.23 C95.+
  Bottom 0.813: C45.1 23.81,90.7 23.87,90.65
  Bottom 1.27: 23.87,90.65 IC7.3
  pour Bottom (isolate 0.305): 23.5,91.44 23.5,87 27.3,87 27.3,91.44
+3V3_ANALOG  (via drill 0.5 pad 1.02)
  Top 0.61: 67.99,43.97 v68.74,43.97 | 67.99,43.97 L3.1 | 67.99,43.97 68.68,43.78 v68.74,43.97 | 67.99,43.97 68.68,44.17 v68.74,43.97
  Bottom 0.61: 68.74,43.22 C14.+ 68.72,36.41 C35.1 C36.1 | 68.74,43.22 v68.74,43.97 | IC3.3 60.52,36.41 C36.1 | C36.1 | 68.74,43.22 68.93,43.92 v68.74,43.97 | 68.74,43.22 68.54,43.92 v68.74,43.97
+3V3_CON  (via drill 0.5 pad 1.02)  (1 unrouted)
  Top 0.406: R59.2 6.83,13.65 7.46,13.02 8.26,13.02 | R86.1 36.67,27.66 36.46,27.45 | SW1.3 36.46,27.45 | 36.46,27.45 34.81,26.42 SW1.3 | 36.46,27.45 35.43,25.8 SW1.3
  Top 0.61: SV1.12 13.34,7.11 | 13.34,7.11 13.34,6.99 12.06,5.71 9.53,5.71 8.26,6.99 8.26,13.02 9.84,13.02 10.74,13.91 R58.2 | R38.2 27.89,20.26 R78.1 | 31.06,21.59 31.06,20.59 R78.2 | 31.06,21.59 R33.2 | v18.1,15.72 18.1,16.47 | 18.1,16.47 18.1,17.2 R52.2 | SW1.2 34.41,21.59 31.06,21.59 | 18.1,16.47 17.9,15.77 v18.1,15.72 | 18.1,16.47 18.29,15.77 v18.1,15.72 | 13.34,7.11 13.8,8.02 SV1.12 | 13.34,7.11 12.87,8.02 SV1.12
  Route2 0.61: 8.89,7.62 10,6.51 13.34,6.51
  Route2 0.813: v20.95,21.59 20.95,18.57 v18.1,15.72 v15.24,15.72 12.54,15.72 8.89,12.06 8.89,7.62 10.16,6.35 30.48,6.35 33.97,9.84 33.97,13.02 31.75,15.24 31.75,18.93 SW1.2 | SV1.12 13.34,6.51
  Route2 1.27: SW1.2 SW1.3
  Bottom 0.406: R63.1 28.57,22.86 29.84,24.13 31.43,24.13
  Bottom 0.61: R56.2 5.71,7.62 6.99,6.35 11.43,6.35 12.53,7.45 | 12.53,7.45 SV1.12 | R30.2 36.83,29.49 36.83,27.82 36.46,27.45 | R40.2 22.6,23.23 21.48,22.12 | v20.95,21.59 21.48,22.12 | R28.2 29.43,29 31.43,26.99 31.43,24.13 31.43,23.18 32.38,22.23 33.05,22.23 | R48.2 14.66,20.26 15.24,19.68 15.24,16.47 | v15.24,15.72 15.24,16.47 | SW1.3 36.46,27.45 | 37.05,22.21 35.06,22.21 SW1.2 | 37.05,22.21 C97.1 | SW1.2 33.05,22.23 | 15.24,16.47 15.04,15.77 v15.24,15.72 | 15.24,16.47 15.44,15.77 v15.24,15.72 | 21.48,22.12 20.86,21.77 v20.95,21.59 | 21.48,22.12 21.13,21.49 v20.95,21.59 | 12.53,7.45 13.49,7.76 SV1.12 | 12.53,7.45 12.84,8.41 SV1.12 | 37.05,22.21 35.18,22.71 SW1.2 | 37.05,22.21 35.17,21.74 SW1.2 | 33.05,22.23 34.92,21.74 SW1.2 | 33.05,22.23 34.92,22.71 SW1.2 | 36.46,27.45 34.8,26.47 SW1.3 | 36.46,27.45 35.48,25.78 SW1.3
+5V  (via drill 0.5 pad 1.02)
  Top 0.254: 17.74,78.6 17.6,78.6 v17.14,79.06 | 17.74,78.6 IC1.1 | 17.74,78.6 17.5,79.2 v17.14,79.06 | 17.74,78.6 17.1,78.68 v17.14,79.06
  Top 0.406: 17.13,79.81 17.13,79.07 v17.14,79.06 | 17.13,79.81 C24.1 | 17.13,79.81 16.86,79.18 v17.14,79.06 | 17.13,79.81 17.42,79.19 v17.14,79.06
  Bottom 0.61: IC7.1 19.31,89 17.51,89 C44.1 15.9,88.96 C43.1 14.37,88.98 13.71,88.32 C10.1 13.71,85.67 L1.2 14.92,85.57 16.03,84.45 16.03,83.19 15.66,82.81 C40.1 15.86,81.72 C39.1 15.86,79.39 16.19,79.06 16.39,79.06 | v17.14,79.06 16.39,79.06 | 60.43,41.11 60.43,41.13 C16.1 63.02,41.12 C15.1 | 16.39,79.06 17.09,78.86 v17.14,79.06 | 16.39,79.06 17.09,79.25 v17.14,79.06
  Bottom 0.813: IC7.1 19.31,91.7 20.32,92.71 64.14,92.71 70.48,86.36 70.48,52.07 68.58,50.16 65.41,50.16 64.53,49.29 C15.1 64.61,41.2 | 60.43,41.11 IC3.1
ANALOG_VCC  (via drill 0.5 pad 1.02)
  Top 0.254: IC5.25 63.39,35.98 63.67,35.7 C50.1 | IC5.24 62.44,34.72 62.87,34.29 | C32.2 | IC5.17 58.94,34.16 C54.2 | C54.2 IC5.16 | C54.2 | 62.87,34.29 | C32.2 62.87,34.29
  Top 0.406: C50.1 65.88,35.7 C53.1 | 63.44,34.29 C32.2 63.44,34.25 C52.2 | C54.2 58.44,32.35 C56.2 C57.2
  Top 0.61: 67.21,35.5 C53.1 | 67.21,35.5 C31.1 67.21,42.02 L3.2 | v63.5,31.27 | 58.26,30.58 58.26,30.64 | C52.2 63.5,32.8 63.5,32.02 | v63.5,31.27 63.5,32.02 | 58.26,30.58 C57.2 | v58.26,29.37 58.26,30.12 | 58.26,30.12 58.26,30.58 | v63.5,31.27 64.03,30.74 | 64.03,30.74 64.77,30 66.36,30 67.21,30.85 67.21,35.5 | 58.26,30.12 58.07,29.42 v58.26,29.37 | 58.26,30.12 58.46,29.42 v58.26,29.37 | 63.5,32.02 63.3,31.33 v63.5,31.27 | 63.5,32.02 63.7,31.33 v63.5,31.27 | 64.03,30.74 63.68,31.37 v63.5,31.27 | 64.03,30.74 63.4,31.1 v63.5,31.27
  Route15 0.61: 62.97,31.8 62.39,32.38 59.69,32.38 58.26,30.96 58.26,30.12 | 62.97,31.8 v63.5,31.27 | v58.26,29.37 58.26,30.12 | 58.26,30.12 58.12,29.4 v58.26,29.37 | 58.26,30.12 58.41,29.4 v58.26,29.37 | 62.97,31.8 63.38,31.19 v63.5,31.27 | 62.97,31.8 63.58,31.4 v63.5,31.27
BCLK  (via drill 0.5 pad 1.02)
  Top 0.254: IC5.38 61.94,43.15 59.69,45.4 59.69,47.78 59.59,47.89 | 59.59,47.89 v59.05,48.42 58.96,48.05 59.59,47.89
  Top 0.406: 44.45,67.3 R20.2 44.62,67.15 45.13,67.15 | 23.35,33.97 R36.2 23.35,43.04 24.77,44.45 24.77,46.35 26.35,47.94 26.83,48.42 29.25,48.42 | 23.18,33.97 22.54,33.97 IC10.5 | 23.18,33.97 IC10.4 | 23.18,33.97 23.35,33.97 | IC10.3 23.81,33.97 23.35,33.97 | v45.88,67.15 45.13,67.15 | 29.25,48.42 v30,48.42 | 45.13,67.15 45.76,66.87 v45.88,67.15 | 45.13,67.15 45.76,67.43 v45.88,67.15 | 29.25,48.42 29.88,48.14 v30,48.42 | 29.25,48.42 29.88,48.7 v30,48.42
  Route15 0.406: 51.91,55.56 45.88,61.59 45.88,65.88 | 51.91,55.56 58.52,48.95 | 58.52,48.95 v59.05,48.42 | 21.86,62.87 25.08,62.87 28.1,65.88 45.88,65.88 | 21.86,62.87 v21.11,62.87 | 45.88,65.88 45.88,66.4 | 45.88,66.4 v45.88,67.15 | v30,48.42 30.75,48.42 | 30.75,48.42 37.15,48.42 38.26,49.53 46.04,49.53 51.91,55.4 51.91,55.56 | 45.88,66.4 46.11,67.07 v45.88,67.15 | 45.88,66.4 45.64,67.07 v45.88,67.15 | 58.52,48.95 58.83,48.31 v59.05,48.42 | 58.52,48.95 59.16,48.64 v59.05,48.42 | 30.75,48.42 30.09,48.65 v30,48.42 | 30.75,48.42 30.09,48.18 v30,48.42 | 21.86,62.87 21.2,63.1 v21.11,62.87 | 21.86,62.87 21.2,62.63 v21.11,62.87
  Bottom 0.406: R88.2 19.86,62.87 20.36,62.87 | v21.11,62.87 20.36,62.87 | R24.2 41.75,69.37 43.97,67.15 45.13,67.15 | v45.88,67.15 45.13,67.15 | 45.13,67.15 45.76,66.87 v45.88,67.15 | 45.13,67.15 45.76,67.43 v45.88,67.15 | 20.36,62.87 20.99,62.59 v21.11,62.87 | 20.36,62.87 20.99,63.14 v21.11,62.87
BCLK_EN_A  (via drill 0.5 pad 1.02)
  Top 0.254: 36.14,57.89 IC1.69
  Top 0.305: R70.1 39.63,44.71 40.01,45.09 40.01,47.62 39.05,48.58 39.05,51.75 36.14,54.66 36.14,57.89
  Top 0.406: R70.1 | v36.2,43.81 36.95,43.81 | 36.95,43.81 R70.1 | 20.95,40.05 20.95,38.1 21.27,37.78 IC10.7 | 20.95,40.05 v20.95,40.8 | 36.95,43.81 36.32,44.09 v36.2,43.81 | 36.95,43.81 36.32,43.54 v36.2,43.81 | 20.95,40.05 21.23,40.67 v20.95,40.8 | 20.95,40.05 20.68,40.67 v20.95,40.8
  Route2 0.406: v20.95,40.8 21.48,41.33 | 21.48,41.33 23.97,43.81 35.45,43.81 | 35.45,43.81 v36.2,43.81 | 35.45,43.81 36.11,43.58 v36.2,43.81 | 35.45,43.81 36.11,44.05 v36.2,43.81 | 21.48,41.33 20.85,41.02 v20.95,40.8 | 21.48,41.33 21.18,40.69 v20.95,40.8
BCLK_EN_B  (via drill 0.5 pad 1.02)
  Top 0.254: IC1.72 37.64,58.72 37.73,58.63 | v38.26,58.1 37.73,58.63 | 37.73,58.63 37.89,58.01 v38.26,58.1 | 37.73,58.63 38.35,58.47 v38.26,58.1
  Route2 0.406: 39.01,58.1 41.59,58.1 47.62,52.07 47.62,44.13 45.93,42.44 | 39.01,58.1 v38.26,58.1 | v45.4,41.91 45.93,42.44 | 45.93,42.44 45.3,42.14 v45.4,41.91 | 45.93,42.44 45.63,41.8 v45.4,41.91 | 39.01,58.1 38.34,58.34 v38.26,58.1 | 39.01,58.1 38.34,57.87 v38.26,58.1
  Bottom 0.305: 44.55,41.91 44.65,41.91 | 44.65,41.91 v45.4,41.91 | 44.65,41.91 45.23,41.6 v45.4,41.91 | 44.65,41.91 45.23,42.22 v45.4,41.91
  Bottom 0.406: R71.1 44.55,41.91 44.55,40.58 40.32,36.35 38.07,36.35 IC9.5
CODEC_DIN  (via drill 0.5 pad 1.02)
  Top 0.254: IC5.40 60.94,42.56 59.69,43.81 59.13,44.37 | 59.13,44.37 58.9,44.61 v58.42,44.61 | 59.13,44.37 58.71,44.86 v58.42,44.61 | 59.13,44.37 58.5,44.24 v58.42,44.61
  Route15 0.406: 64.75,80.01 66.04,80.01 67.31,78.74 67.31,57.63 63.34,53.66 63.34,45.24 62.07,43.97 59.05,43.97 58.95,44.08 | 64.75,80.01 SW2.2 | v58.42,44.61 58.95,44.08 | 58.95,44.08 58.65,44.72 v58.42,44.61 | 58.95,44.08 58.31,44.38 v58.42,44.61 | 64.75,80.01 63.89,80.59 SW2.2 | 64.75,80.01 63.89,79.43 SW2.2
CON_BCLK
  Top 0.406: IC10.13 23.18,25.24 22.54,25.24 | 22.54,25.24 IC10.12 | IC10.11 21.91,25.24 22.53,25.24 | 22.53,25.24 22.54,25.24 | 22.53,25.24 R37.1 22.53,22.88 22.86,22.54 22.86,12.22 22.23,11.59 22.23,9.53 22.69,9.06 | 22.69,9.06 SV1.4 | 22.69,9.06 22.89,8.12 SV1.4 | 22.69,9.06 23.62,8.86 SV1.4
CON_BCLK_EN_B  (via drill 0.5 pad 1.02)
  Top 0.406: v21.27,23.97 21.27,24.72 | 21.27,24.72 IC10.10 | 21.27,24.72 20.99,24.09 v21.27,23.97 | 21.27,24.72 21.55,24.09 v21.27,23.97
  Route15 0.406: 34.24,31.7 33.02,30.48 27.78,30.48 21.8,24.5 | 34.24,31.7 v34.77,32.23 | v21.27,23.97 21.8,24.5 | 34.24,31.7 34.87,32 v34.77,32.23 | 34.24,31.7 34.54,32.33 v34.77,32.23 | 21.8,24.5 21.16,24.2 v21.27,23.97 | 21.8,24.5 21.5,23.86 v21.27,23.97
  Bottom 0.406: v34.77,32.23 34.29,31.75 34.19,31.75 | 34.19,31.75 33.47,31.75 IC9.12 | 34.19,31.75 34.85,31.93 v34.77,32.23 | 34.19,31.75 34.49,32.36 v34.77,32.23
CON_FRAME_SYNC
  Bottom 0.406: IC12.11 25.72,28.42 25.08,28.42 | IC12.13 24.45,28.42 25.08,28.42 | 25.08,28.42 IC12.12 | 25.08,28.42 25.08,27.46 R42.1 25.1,21.92 23.5,20.32 23.5,11.94 | SV1.3 23.5,11.94 | 23.5,11.94 22.97,11.13 SV1.3 | 23.5,11.94 24.02,11.13 SV1.3
CON_FS_EN_B  (via drill 0.5 pad 1.02)
  Route15 0.406: v26.35,27.46 28.57,29.69 33.66,29.69 34.4,30.43 | 34.4,30.43 v34.92,30.96 | 34.4,30.43 35.03,30.73 v34.92,30.96 | 34.4,30.43 34.7,31.06 v34.92,30.96 | v26.35,27.46 26.25,27.69 26.88,27.99 26.58,27.36 v26.35,27.46
  Bottom 0.406: v26.35,27.46 26.35,28.21 | 26.35,28.21 IC12.10 | v34.92,30.96 34.17,30.96 | 34.17,30.96 33.57,30.96 IC9.11 | 34.17,30.96 34.8,30.68 v34.92,30.96 | 34.17,30.96 34.8,31.23 v34.92,30.96 | 26.35,28.21 26.07,27.59 v26.35,27.46 | 26.35,28.21 26.63,27.59 v26.35,27.46
CON_MCLK
  Top 0.406: SV1.2 27.18,8.26 | 27.18,8.26 28.57,8.26 29.84,9.53 29.84,13.34 29.35,13.83 R32.1 29.37,26.04 29.37,27.15 | 29.53,27.15 IC6.12 | 29.37,27.15 29.53,27.15 | IC6.11 28.89,27.15 29.37,27.15 | IC6.13 30.16,27.15 29.53,27.15 | 27.18,8.26 26.37,8.78 SV1.2 | 27.18,8.26 26.37,7.73 SV1.2
CON_MCLK_EN_B  (via drill 0.5 pad 1.02)
  Top 0.406: 28.26,26.87 28.26,26.51 v27.94,26.19 | 28.26,26.87 IC6.10 | 28.26,26.87 27.74,26.42 v27.94,26.19 | 28.26,26.87 28.25,26.19 v27.94,26.19
  Route15 0.406: v33.66,32.86 34.13,33.34 34.23,33.34 | 34.23,33.34 35.08,33.34 35.88,32.54 35.88,30.48 34.29,28.89 29.05,28.89 27.94,27.78 27.94,26.94 | 27.94,26.94 v27.94,26.19 | 27.94,26.94 27.7,26.28 v27.94,26.19 | 27.94,26.94 28.18,26.28 v27.94,26.19 | 34.23,33.34 33.57,33.1 v33.66,32.86 | 34.23,33.34 33.87,32.73 v33.66,32.86
  Bottom 0.406: v33.66,32.86 33.66,32.83 33.14,32.32 | 33.14,32.32 IC9.13 | 33.14,32.32 33.77,32.58 v33.66,32.86 | 33.14,32.32 33.37,32.96 v33.66,32.86
CON_MUTE
  Bottom 0.406: IC14.11 10.48,18.57 10.18,18.57 | 9.84,18.57 9.21,18.57 IC14.13 | 9.84,18.57 IC14.12 | 10.18,18.57 R55.1 10.18,13.96 12.06,12.06 12.06,10.16 12.7,9.53 13.97,9.53 14.61,8.89 14.61,5.87 | 10.18,18.57 9.84,18.57 | 14.61,5.87 R7.1 | 14.61,5.87 14.61,4.13 R6.1
CON_MUTE_EN_B  (via drill 0.5 pad 1.02)
  Top 0.406: v7.94,15.4 7.94,16.15 | 7.94,16.15 IC15.12 | 7.94,16.15 7.66,15.52 v7.94,15.4 | 7.94,16.15 8.22,15.52 v7.94,15.4
  Route15 0.406: v7.94,15.4 7.94,16.15 | 7.94,16.15 7.94,17.14 9.05,18.26 12.59,18.26 | 12.59,18.26 v13.34,18.26 | 12.59,18.26 13.25,18.02 v13.34,18.26 | 12.59,18.26 13.25,18.49 v13.34,18.26 | 7.94,16.15 7.7,15.48 v7.94,15.4 | 7.94,16.15 8.17,15.48 v7.94,15.4
  Bottom 0.406: IC14.10 11.11,18.73 11.59,18.26 12.59,18.26 | v13.34,18.26 12.59,18.26 | 12.59,18.26 13.21,17.98 v13.34,18.26 | 12.59,18.26 13.21,18.54 v13.34,18.26
CON_RESET
  Top 0.406: R5.1 R8.2 17.57,14.19 17.14,14.61 17.14,18.73 16.67,19.21 15.56,19.21 15.38,19.38 R51.1 15.38,21.27 | 15.56,21.27 IC13.12 | IC13.13 16.19,21.27 15.56,21.27 | IC13.11 14.92,21.27 15.38,21.27 | 15.38,21.27 15.56,21.27
CON_RST_EN_B
  Top 0.406: IC15.11 7.3,21.59 11.43,21.59 11.75,21.27 14.13,21.27 14.29,21.43 IC13.10
CON_RX_DATA
  Bottom 0.406: 18.1,24.13 IC11.11 | IC11.12 17.46,24.77 18.1,24.13 | SV1.8 19.22,9.06 | 19.22,9.06 19.68,9.53 19.68,12.86 20.95,14.13 20.95,17.3 18.1,20.16 18.1,24.13 | 19.22,9.06 18.28,8.86 SV1.8 | 19.22,9.06 19.02,8.12 SV1.8
CON_TX_DATA
  Bottom 0.406: IC11.13 16.83,24.29 17.3,23.81 17.3,21.89 | 17.3,21.89 R45.1 | 17.3,21.89 17.3,19.53 20,16.83 20,14.61 17.14,11.75 17.14,6.99 17.46,6.67 19.37,6.67 20.15,7.45 | 20.15,7.45 SV1.6 | 20.15,7.45 21.09,7.65 SV1.6 | 20.15,7.45 20.35,8.39 SV1.6
CON_TX_EN_B  (via drill 0.5 pad 1.02)
  Route15 0.406: 32.65,33.6 32.54,33.5 32.54,31.75 32.07,31.27 27.3,31.27 20.95,24.92 20.16,24.92 19.58,24.34 | 32.65,33.6 v33.18,34.13 | v19.05,23.81 19.58,24.34 | 19.58,24.34 18.94,24.04 v19.05,23.81 | 19.58,24.34 19.28,23.7 v19.05,23.81 | 32.65,33.6 33.29,33.91 v33.18,34.13 | 32.65,33.6 32.95,34.24 v33.18,34.13
  Bottom 0.406: 18.73,24.49 18.73,24.13 v19.05,23.81 | 18.73,24.49 IC11.10 | IC9.14 32.62,32.7 32.62,33.58 32.65,33.6 | v33.18,34.13 32.65,33.6 | 18.73,24.49 18.75,23.81 v19.05,23.81 | 18.73,24.49 19.25,24.04 v19.05,23.81 | 32.65,33.6 33.29,33.85 v33.18,34.13 | 32.65,33.6 32.89,34.24 v33.18,34.13
CON_VOLTAGE  (via drill 0.5 pad 1.02)
  Top 0.254: IC1.109 37.96,80.35 38.05,80.43 | v38.58,80.96 38.05,80.43 | 38.05,80.43 38.67,80.59 v38.58,80.96 | 38.05,80.43 38.21,81.06 v38.58,80.96
  Top 0.406: C51.1 OK1.4 | v40.96,33.81 40.21,33.81 | 40.21,33.81 39.37,33.81 38.73,34.45 OK1.4 | R87.2 38.42,36.2 OK1.4 | 40.21,33.81 40.83,33.53 v40.96,33.81 | 40.21,33.81 40.83,34.09 v40.96,33.81
  Route2 0.406: 37.83,80.96 29.53,80.96 28.57,80.01 28.57,73.18 29.95,71.81 | 37.83,80.96 v38.58,80.96 | v30.48,71.28 29.95,71.81 | 37.83,80.96 38.49,80.73 v38.58,80.96 | 37.83,80.96 38.49,81.2 v38.58,80.96 | 29.95,71.81 30.25,71.17 v30.48,71.28 | 29.95,71.81 30.59,71.5 v30.48,71.28
  Route15 0.406: 40.21,33.81 36.04,33.81 34.77,35.08 32.54,35.08 31.11,33.66 20.32,33.66 15.88,38.1 15.88,60.96 19.05,64.14 23.34,64.14 29.95,70.75 | 40.21,33.81 v40.96,33.81 | 29.95,70.75 v30.48,71.28 | 40.21,33.81 40.87,33.58 v40.96,33.81 | 40.21,33.81 40.87,34.05 v40.96,33.81 | 29.95,70.75 30.59,71.05 v30.48,71.28 | 29.95,70.75 30.25,71.39 v30.48,71.28
  Bottom 0.406: C99.1 C98.1 39.83,80.96 39.33,80.96 | v38.58,80.96 39.33,80.96 | 39.33,80.96 38.7,81.24 v38.58,80.96 | 39.33,80.96 38.7,80.68 v38.58,80.96
DMHS
  Top 0.254: R10.1 15.37,76.6 IC1.5
  Top 0.406: X2.2 11.6,83.66 12.86,82.39 12.86,81.28 12.7,81.12 12.7,78.3 IC2.2 12.69,77.32 13.28,76.73 R10.1
DPHS
  Top 0.254: R11.1 13.28,75.88 16.19,75.88 16.41,76.1 IC1.6
  Top 0.406: X2.3 10.79,82.71 10.48,82.39 10.48,81.6 10.81,81.27 IC2.1 10.81,76.82 11.85,75.78 R11.1
ERROR_SIG  (via drill 0.5 pad 1.02)
  Top 0.254: IC1.98 40.8,73.6 40.8,72.82 | v40.8,72.07 40.8,72.82 | 40.8,72.82 40.47,72.27 v40.8,72.07 | 40.8,72.82 41.13,72.27 v40.8,72.07
  Route2 0.406: 59.32,56.25 54.61,60.96 47.62,60.96 45.72,62.87 45.72,65.25 47.15,66.67 47.15,70.96 46.04,72.07 41.55,72.07 | 59.32,56.25 v59.85,55.72 | 41.55,72.07 v40.8,72.07 | 41.55,72.07 40.88,72.31 v40.8,72.07 | 41.55,72.07 40.88,71.84 v40.8,72.07 | 59.32,56.25 59.62,55.61 v59.85,55.72 | 59.32,56.25 59.96,55.95 v59.85,55.72
  Bottom 0.406: R64.1 59.16,56.41 59.32,56.25 | v59.85,55.72 59.32,56.25 | 59.32,56.25 59.56,55.61 v59.85,55.72 | 59.32,56.25 59.96,56.01 v59.85,55.72
FRAME_SYNC  (via drill 0.5 pad 1.02)
  Top 0.254: IC5.39 61.44,42.86 59.05,45.24 59.05,46.67 58.79,46.94 | v58.26,47.47 58.79,46.94 | IC1.44 23.64,60.33 23.65,60.33 | 58.79,46.94 58.63,47.56 v58.26,47.47 | 58.79,46.94 58.17,47.1 v58.26,47.47
  Top 0.305: 23.65,60.8 23.65,60.33
  Top 0.406: v46.04,70.48 45.51,71.02 | 45.51,71.02 45.4,71.12 R23.2 | R22.2 45.4,69.85 45.51,69.95 | v46.04,70.48 45.51,69.95 | 23.65,60.8 23.65,61.59 25.24,63.18 27.82,63.18 | v28.57,63.18 27.82,63.18 | 45.51,71.02 45.75,70.38 v46.04,70.48 | 45.51,71.02 46.15,70.77 v46.04,70.48 | 45.51,69.95 46.15,70.2 v46.04,70.48 | 45.51,69.95 45.75,70.59 v46.04,70.48 | 27.82,63.18 28.45,62.9 v28.57,63.18 | 27.82,63.18 28.45,63.46 v28.57,63.18
  Route2 0.406: 39.37,60.96 38.1,60.96 36.2,59.05 31.59,59.05 28.57,62.07 28.57,62.43 | 39.37,60.96 44.77,60.96 57.73,48 | 57.73,48 v58.26,47.47 | 45.29,70.48 43.81,70.48 39.37,66.04 39.37,60.96 | 45.29,70.48 v46.04,70.48 | v28.57,63.18 28.57,62.43 | 57.73,48 58.03,47.36 v58.26,47.47 | 57.73,48 58.37,47.69 v58.26,47.47 | 45.29,70.48 45.95,70.25 v46.04,70.48 | 45.29,70.48 45.95,70.72 v46.04,70.48 | 28.57,62.43 28.81,63.1 v28.57,63.18 | 28.57,62.43 28.34,63.1 v28.57,63.18
  Bottom 0.406: IC12.3 23.81,37.62 24.11,37.62 | IC12.5 25.08,37.62 24.45,37.62 | 24.45,37.62 IC12.4 | 24.11,37.62 R41.2 24.11,39.54 23.65,40.01 23.65,41.91 26.19,44.45 27.94,44.45 28.57,45.09 28.57,46.35 27.78,47.15 26.83,47.15 26.19,47.78 26.19,60.8 28.05,62.65 | 24.45,37.62 24.11,37.62 | 28.05,62.65 v28.57,63.18 | 28.05,62.65 28.68,62.9 v28.57,63.18 | 28.05,62.65 28.29,63.29 v28.57,63.18
FS_EN_A  (via drill 0.5 pad 1.02)  (1 unrouted)
  Top 0.254: IC1.63 33.14,57.34 33.34,57.15 33.34,56.52
  Top 0.305: v36.51,49.53 36.51,50.28 | 36.51,50.28 36.51,51.75 35.88,52.39 34.77,52.39 33.34,53.82 33.34,56.52 | 36.51,50.28 36.2,49.7 v36.51,49.53 | 36.51,50.28 36.83,49.7 v36.51,49.53
  Bottom 0.406: IC12.7 26.35,39.53 25.4,40.48 25.4,41.43 25.88,41.91 29.84,41.91 31.59,43.66 31.59,46.83 34.29,49.53 35.76,49.53 | v36.51,49.53 37.26,49.53 | 37.26,49.53 43.18,49.53 45.09,47.62 R72.1 | 35.76,49.53 v36.51,49.53 | 37.26,49.53 36.64,49.81 v36.51,49.53 | 37.26,49.53 36.64,49.25 v36.51,49.53 | 35.76,49.53 36.39,49.25 v36.51,49.53 | 35.76,49.53 36.39,49.81 v36.51,49.53
FS_EN_B  (via drill 0.5 pad 1.02)
  Top 0.254: IC1.70 36.64,61.47 36.57,61.54 | v36.04,62.07 36.57,61.54 | 36.57,61.54 36.41,62.17 v36.04,62.07 | 36.57,61.54 35.94,61.7 v36.04,62.07
  Bottom 0.406: IC9.6 38.18,35.56 40.64,35.56 46.51,41.43 46.51,42.55 48.26,44.29 49.37,44.29 50.16,45.09 50.16,46.83 50.96,47.62 R73.1 52.33,49.9 40.16,62.07 36.79,62.07 | 36.79,62.07 v36.04,62.07 | 36.79,62.07 36.16,62.35 v36.04,62.07 | 36.79,62.07 36.16,61.79 v36.04,62.07
GND  (via drill 0.5 pad 1.02)
  Top 0.254: C17.2 27.15,82.07 26.64,81.57 IC1.131 26.64,79.35 26.35,79.06 | IC1.140 22.14,79.06 | 20.14,79.06 IC1.144 20.14,80.33 C24.2 | IC1.102 40.13,75.6 40.32,75.41 | IC5.42 59.94,42.77 59.44,42.77 IC5.43 59.44,43.27 59.05,43.66 57.94,43.66 57.47,44.13 57.47,46.04 57.09,46.41 C33.2 | IC5.45 58.44,42.37 58.1,42.7 57.94,42.7 | 57.94,42.7 IC5.46 | 57.94,42.7 55.55,42.7 C34.2 | IC1.7 19.09,75.6 19.37,75.88 19.37,76.83 19.1,77.1 IC1.4 16.72,77.1 16.19,77.63 14.11,77.63 R14.1 | C22.2 41.58,65.6 IC1.82 37.27,65.6 36.83,66.04 | 21.59,69.85 20.84,69.1 IC1.20 16.06,69.1 C27.2 | 34.45,58.26 34.14,58.57 IC1.65 34.14,60.95 34.13,60.96 | IC1.47 25.14,58.32 24.92,58.1 24.92,57.32 C26.2 | 33.34,78.9 33.64,79.2 IC1.117 33.64,81.11 34.13,81.6 34.13,82.38 C4.2
  Top 0.305: 40.32,75.41 40.48,75.25 40.48,74.77 40.97,74.28 C21.2 | R85.2 25.73,54.78 25.24,54.29 | IC15.2 9.84,27 C89.2 | 10.16,29.05 9.37,29.05 8.89,29.53 8.89,30.48 8.57,30.8 | 6.35,29.69 6.51,29.69 | 6.35,29.69 5.4,29.69 | R90.2 6.49,29.54 6.35,29.69
  Top 0.406: IC2.3 11.75,81.17 | 11.75,81.17 v11.75,81.92 | C88.2 10.3,28.85 C89.2 | IC13.2 17.46,30.16 C81.2 17.61,31.43 C80.2 | 20.16,36.04 20.64,35.56 IC10.8 20.64,30.8 22.07,30.8 | IC10.2 24.45,34.3 C65.2 24.59,36.2 C64.2 | 27.3,40.32 27.62,40.01 IC6.8 27.62,32.7 29.37,32.7 | IC6.2 31.43,36.35 C18.2 32.21,37.94 C3.2 | C23.2 19.37,85.88 19.37,84.61 | C55.2 63.33,44.09 C46.2 | C4.2 C1.2 | 6.03,24.13 6.03,24.92 | 9.84,24.56 9.84,24.29 | 9.84,24.56 IC15.2 | R61.1 14.13,50.5 14.13,46.67 13.02,46.67 C93.2 | IC13.8 13.65,29.37 13.34,29.69 | 13.65,27.62 13.65,26.67 | 11.75,81.17 12.03,81.79 v11.75,81.92 | 11.75,81.17 11.47,81.79 v11.75,81.92 | 9.84,24.56 9.56,23.94 v9.84,23.81 10.12,23.94 9.84,24.56
  Bottom 0.254: IC4.8 11.95,71.75 | 11.95,71.75 v12.7,71.75 | v12.7,71.75 13.2,72.25 13.26,72.25 | 13.26,72.25 IC4.2 | IC4.5 13.22,70.75 12.94,71.04 | 12.94,71.04 12.7,71.28 v12.7,71.75 | 11.95,71.75 12.51,71.43 v12.7,71.75 | 11.95,71.75 12.51,72.08 v12.7,71.75 | 13.26,72.25 12.63,72.13 v12.7,71.75 | 13.26,72.25 13.06,71.64 v12.7,71.75 | 12.94,71.04 13.07,71.67 v12.7,71.75 | 12.94,71.04 12.45,71.47 v12.7,71.75
  Bottom 0.406: C73.2 23.18,37 IC12.2 23.18,33.97 | IC9.2 35.26,36.23 C59.2 35.26,38.89 C58.2 | IC11.2 15.56,33.97 C77.2 15.41,35.56 C76.2 | C84.2 7.16,29.05 C85.2 7.94,27.46 IC14.2 7.94,23.97 8.1,23.81 | 11.27,23.81 11.75,23.81 IC14.8 11.75,26.99 12.22,27.46 | IC12.8 26.99,33.97 23.18,33.97 | 22.07,33.97 23.18,33.97 | 16.99,30.16 19.37,30.16 IC11.8 19.37,33.97 19.68,34.29 | 15.56,30.32 15.56,31.75 | 38.89,33.81 38.26,33.81 37.47,33.02 | 36.2,31.43 36.2,31.75 36.83,32.38
  other vias: 14.13,81.12 19.37,81.92 22.07,87.63 36.51,85.25 22.54,77.47 54.29,43.34 34.45,54.61 13.02,59.21 20.95,42.39 33.02,40.32 18.26,47.62 28.57,39.53 71.91,47.94 38.74,88.42 2.86,92.71 6.19,74.61 1.11,25.72 1.11,35.4 1.11,44.93 1.11,54.45 1.11,63.98 1.11,73.5 1.11,83.03 70.17,92.71 71.91,83.19 71.91,73.66 71.91,64.14 71.91,54.29 53.97,91.44 59.05,80.64 66.04,83.19 45.08,80.17 32.7,68.26 23.97,68.9 46.83,72.71 49.69,49.53 28.89,49.69 10.79,92.71 43.5,26.67 43.5,31.27 43.5,21.59 43.5,16.51 43.5,11.43 48.26,35.88 47.47,56.51 32.7,74.93 68.1,47.94 43.5,1.11 49.53,8.26 54.13,1.11 50.01,59.69 58.26,55.24 6.35,89.38 9.21,82.07 9.21,80.01 10.79,89.38 4.13,83.03 49.53,37.78 49.53,40.96 58.26,59.69 42.39,54.61
  pour Top (isolate 0.305, rank 6): -8.89,99.69 85.09,99.69 85.09,-12.7 -8.89,-12.7
  pour Bottom (isolate 0.305, rank 6): -16.51,99.69 92.08,99.69 92.08,-12.7 -16.51,-12.7
  pour Route2 (isolate 0.406, rank 6): -11.43,99.69 87,99.69 87,-12.7 -11.43,-12.7
  pour Route15 (isolate 0.406, rank 6): -13.97,99.69 89.53,99.69 89.53,-12.7 -13.97,-12.7
GND2  (via drill 0.5 pad 1.02)
  Top 0.305: C71.2 24.45,25.24 | IC6.9 27.62,27.3 26.83,26.51 26.83,26.04 28.26,24.61 28.26,22.54 | IC15.9 6.03,18.89 5.56,18.41 | IC13.15 17.46,21.27 17.92,21.27 C83.2 | 20.64,26.51 20.64,25.88 20.32,25.56 | 25.56,23.5 25.56,22.86 24.77,22.86 24.13,22.23
  Top 0.406: IC15.9 4.93,20.17 4.45,19.68 | IC15.15 9.84,18.56 C91.2 10.46,16.63 C90.2 | 17.14,9.53 19.68,9.53 SV1.5 | IC13.9 13.65,24.13 14.13,24.61 | 17.78,24.61 17.46,24.29 IC13.15 | C82.2 17.92,19.17 C83.2 | IC10.9 20.64,28.73 20.95,29.05 | 24.61,28.89 24.45,28.73 IC10.15 24.45,25.39 C71.2 | 27.62,29.21 27.62,30.64 | 31.59,30.8 31.43,30.8 IC6.15 31.43,27.15 C63.2 31.58,24.96 C62.2 | 6.03,20.95 6.03,21.59 | 24.61,25.24 24.61,24.55 C66.2
  Bottom 0.406: C86.2 7.16,16.83 C87.2 7.94,18.41 IC14.15 7.94,21.91 | IC14.9 11.75,21.91 7.94,21.91 | 7.94,21.91 4.76,21.91 | C74.2 22.56,27.03 C75.2 23.18,29.2 IC12.15 23.18,31.75 23.5,32.07 | 26.67,32.23 26.99,31.91 IC12.9 26.99,28.73 27.15,28.57 | 15.72,28.42 15.56,28.26 IC11.15 15.56,24.61 C79.2 | 19.68,24.77 19.37,25.08 IC11.9 19.37,28.1 | 29.69,30.16 29.69,30.66 IC9.15 31.43,32.41 31.43,32.86 31.11,33.18 31.11,33.97 | 32.86,28.42 32.38,27.94 32.38,27.62
  other vias: 3.49,22.07 9.05,16.19 20.16,23.02 13.34,19.68 3.49,11.59 3.49,1.11 13.02,1.11 22.54,1.11 32.07,1.11 32.07,5.4 26.04,15.88
  pour Bottom (isolate 0.305): 33.02,-5.71 -5.08,-5.71 -5.08,22.86 13.34,22.86 13.34,29.21 20.32,29.21 20.32,33.02 27.3,33.02 29.84,35.56 30.48,35.56 36.83,29.21 41.27,29.21 42.55,27.94 42.55,19.68 31.75,19.68 31.75,13.97 33.02,12.7
  pour Top (isolate 0.305): 33.02,-0.64 -0.64,-0.64 -0.64,22.86 12.86,22.86 12.86,25.4 19.37,25.4 19.37,29.84 26.83,29.84 26.83,31.75 41.27,31.75 42.55,30.48 42.55,19.68 33.02,19.68 31.75,18.41 31.75,13.97 33.02,12.7
  pour Route2 (isolate 0.406): 33.02,-1.91 33.02,12.7 31.75,13.97 31.75,18.41 33.02,19.68 42.55,19.68 42.55,30.48 41.27,31.75 26.83,31.75 26.83,29.84 19.37,29.84 19.37,25.4 12.86,25.4 12.86,22.86 -1.91,22.86 -1.91,-1.91
  pour Route15 (isolate 0.406): 33.02,-3.81 33.02,12.7 31.75,13.97 31.75,19.68 42.55,19.68 42.55,27.94 41.27,29.21 38.73,29.21 38.73,33.02 20.32,33.02 20.32,29.21 13.34,29.21 13.34,22.86 -3.17,22.86 -3.17,-3.81
GNDA  (via drill 0.5 pad 1.02)
  Top 0.254: 59.94,36.58 IC5.19 59.94,34.36 | 59.94,36.58 59.69,36.83 58.42,36.83 57.94,36.35 IC5.15 57.94,34.46 C54.1 | 60.94,36.53 IC5.21 60.94,34.27 | 60.94,36.53 60.64,36.83 | 61.44,36.52 IC5.22 61.44,34.29 | 61.44,36.52 61.59,36.67 61.78,36.48 IC5.26 63.77,36.48 C50.2 | 59.94,36.58 60.33,36.58 60.33,36.83 60.44,36.72 IC5.20 60.44,34.33 | 60.94,36.53 61.44,36.53 61.44,36.52
  Top 0.305: C56.1 56.62,32.8 56.99,33.18 56.99,33.51 C54.1
  Top 0.406: C56.1 C57.1 | C56.1
  Bottom 0.813: v56.52,29.05 | v56.52,29.05 R4.1 | v56.52,29.05 56.52,27.6 R89.1
  other vias: 60.64,31.27 61.28,30.16 65.88,38.73 65.25,31.11 54.93,29.05 52.71,30.48 60.64,33.5 64.61,38.74 71.91,44.13 71.91,34.33 71.91,39.23 71.91,29.25 71.91,24.17 71.91,19.09 71.91,14.01 71.91,8.93 71.91,3.85 69.53,1.15 61.91,1.15 56.83,1.15 54.29,11.47 45.72,11.47 45.72,16.55 45.72,21.63 45.72,26.71 46.99,31.32 49.85,34.33 53.34,34.33 60.96,21.79 68.58,21.63 52.7,22.43 58.1,17.19 59.69,11.47 59.69,7.03
  pour Top (isolate 0.305): 73.66,-0.64 55.24,-0.64 55.24,8.89 54.61,9.53 45.09,9.53 44.45,10.16 44.45,30.48 54.61,40.64 63.5,40.64 66.04,43.18 66.04,45.09 73.66,45.09